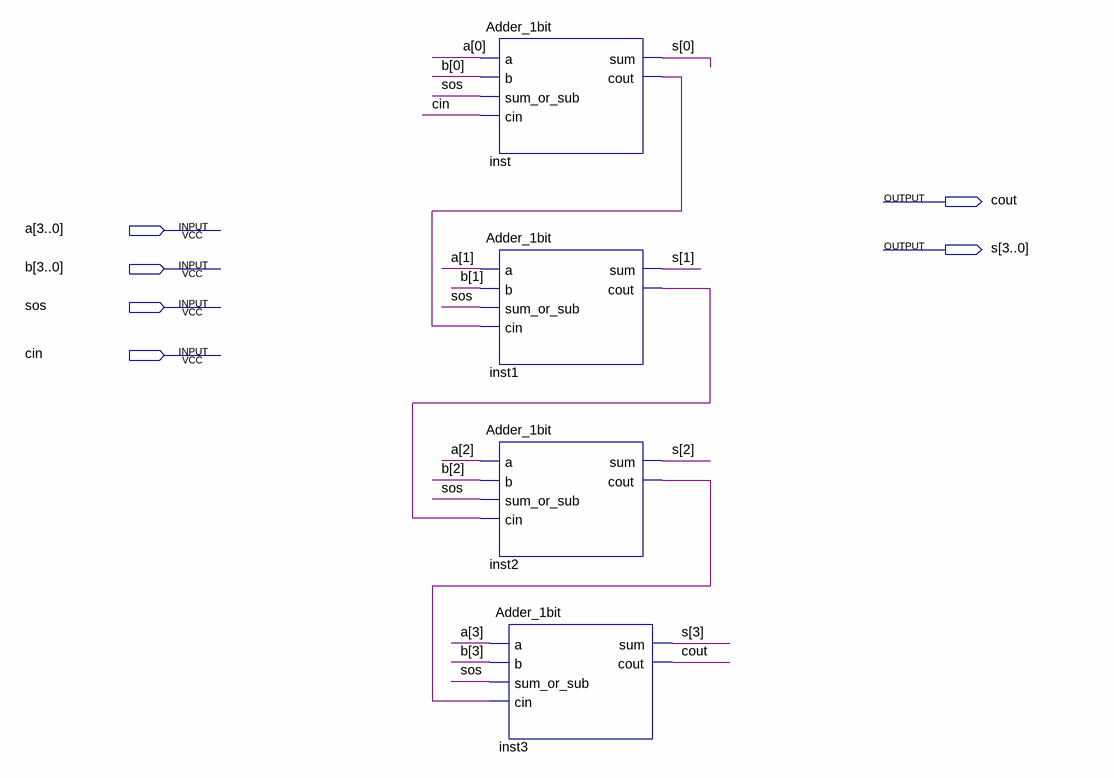
[diagram p0: schematic sheet]
// Quartus schematic Adder_4bit.bdf as structural Verilog: 4 symbols, 6 pins
module Adder_4bit (
  input  [3:0] a,
  input  [3:0] b,
  input  sos,
  input  cin,
  output cout,
  output [3:0] s
);

  wire inst1_cout, inst2_cout, inst_cout;

  Adder_1bit inst (.a(a[0]), .b(b[0]), .sum_or_sub(sos), .cin(cin), .sum(s[0]), .cout(inst_cout));
  Adder_1bit inst1 (.a(a[1]), .b(b[1]), .sum_or_sub(sos), .cin(inst_cout), .sum(s[1]), .cout(inst1_cout));
  Adder_1bit inst2 (.a(a[2]), .b(b[2]), .sum_or_sub(sos), .cin(inst1_cout), .sum(s[2]), .cout(inst2_cout));
  Adder_1bit inst3 (.a(a[3]), .b(b[3]), .sum_or_sub(sos), .cin(inst2_cout), .sum(s[3]), .cout(cout));
endmodule
